# EAGLE schematic HM_EX_ (EAGLE 9.2.2)
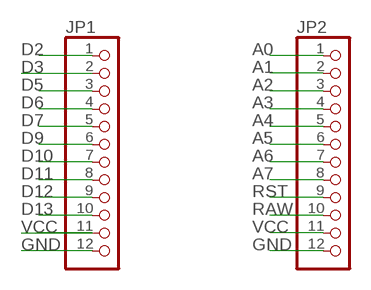
[diagram p0: schematic, sheet 1]

## Parts
JP1  PINHD-1X12  [1X12]
JP2  PINHD-1X12  [1X12]

## Nets
A0: JP2.1
A1: JP2.2
A2: JP2.3
A3: JP2.4
A4: JP2.5
A5: JP2.6
A6: JP2.7
A7: JP2.8
D2: JP1.1
D3: JP1.2
D5: JP1.3
D6: JP1.4
D7: JP1.5
D9: JP1.6
D10: JP1.7
D11: JP1.8
D12: JP1.9
D13: JP1.10
GND: JP1.12 JP2.12
RAW: JP2.10
RST: JP2.9
VCC: JP1.11 JP2.11

## Library data of the parts
JP1 JP2 = adafruit:PINHD-1X12: PIN HEADER